# Altium project Guitar_Headphone_Amp.PrjPcb
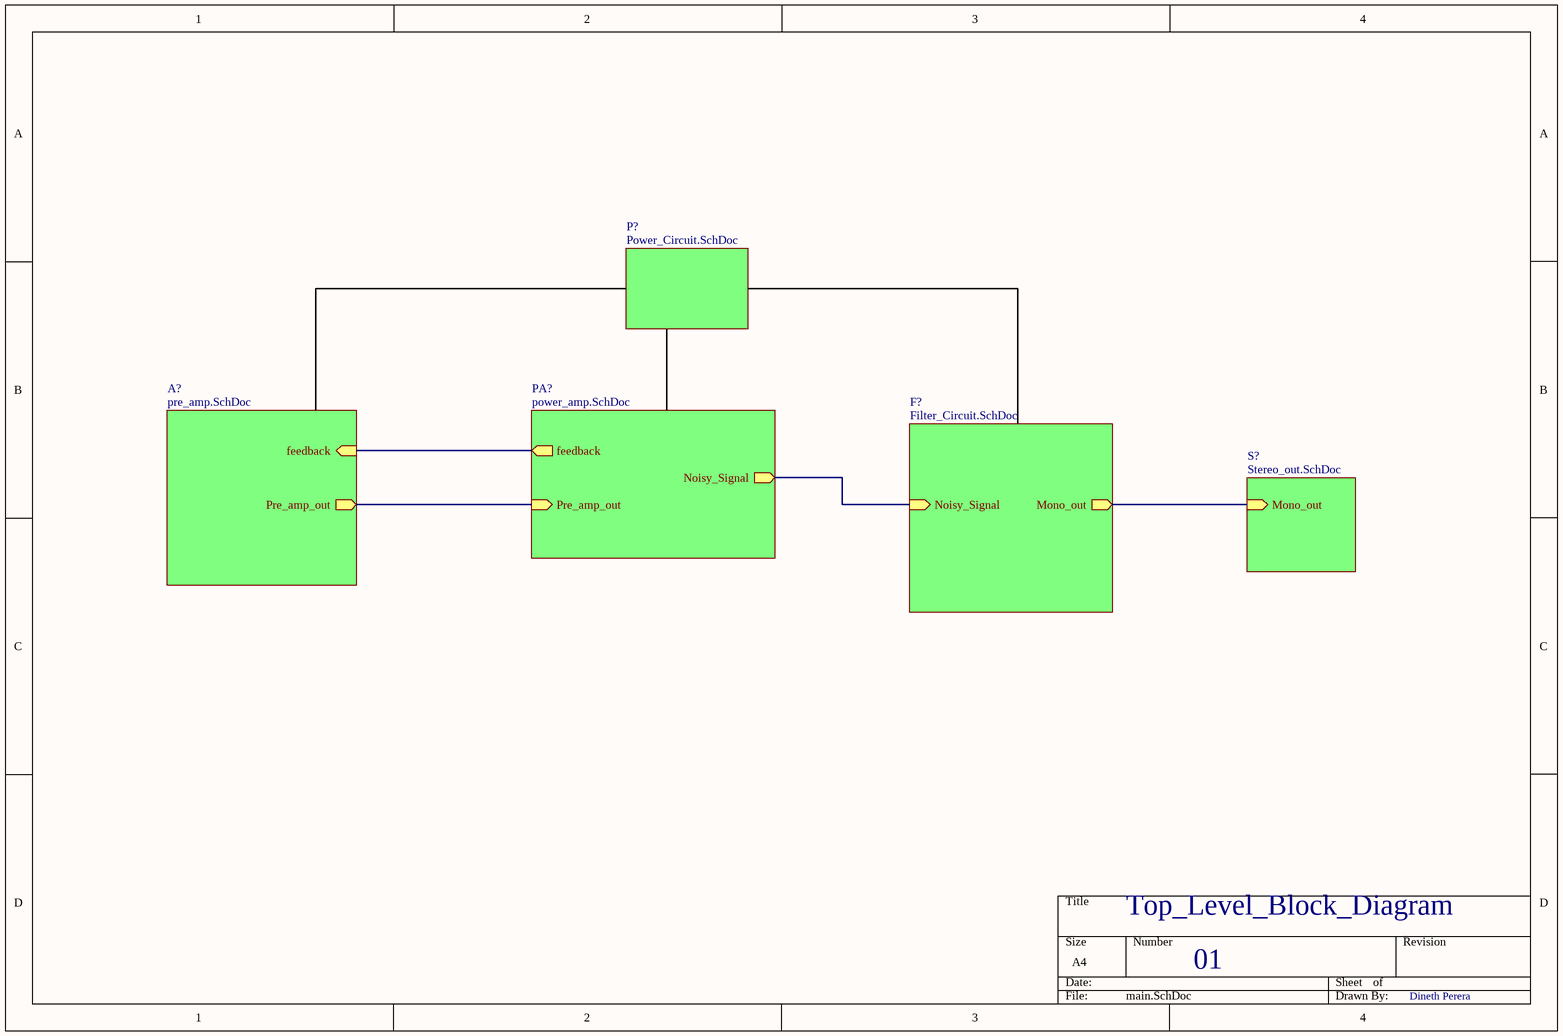
[diagram p0: main.SchDoc]
4 sheets, 20 parts. Net scope: hierarchical (ports join the sheet entries above them; power ports are global).
Board file: Guitar_Headphone_Amp.PcbDoc
Sheets:
  main.SchDoc
    A? = pre_amp.SchDoc
    PA? = power_amp.SchDoc
    P? = Power_Circuit.SchDoc

## Sheet main.SchDoc
size A4; SheetNumber: 1; SheetTotal: 6

### Sub-sheets
A? = pre_amp.SchDoc: feedback (in), Pre_amp_out (out)
F? = Filter_Circuit.SchDoc (file not in this document): Noisy_Signal (in), Mono_out (out)
P? = Power_Circuit.SchDoc: no entries
PA? = power_amp.SchDoc: feedback (out), Pre_amp_out (in), Noisy_Signal (out)
S? = Stereo_out.SchDoc (file not in this document): Mono_out (in)

### Nets
NetD1_1: sheet A?/Pre_amp_out, sheet PA?/Pre_amp_out
NetR2_2: sheet A?/feedback, sheet PA?/feedback
NetR6_1: sheet PA?/Noisy_Signal, sheet F?/Noisy_Signal
(unnamed): sheet F?/Mono_out, sheet S?/Mono_out

### Notes on the sheet
- Top_Level_Block_Diagram
- 01
- Dineth Perera

## Sheet pre_amp.SchDoc
size A4; SheetNumber: 2; SheetTotal: 6
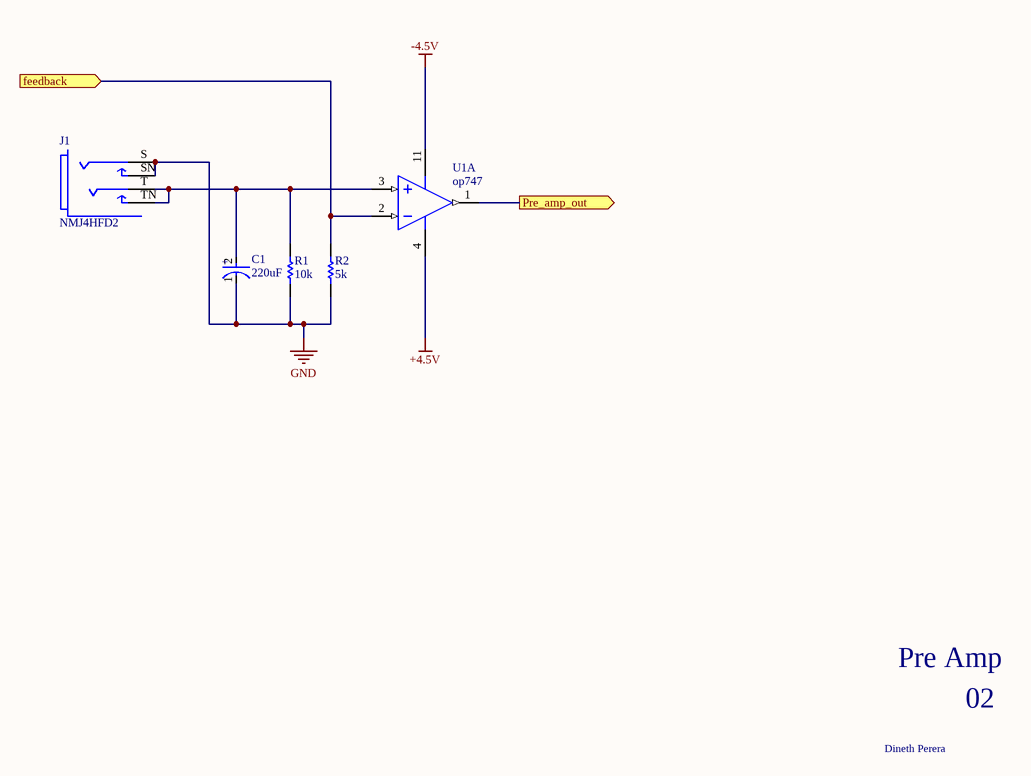
[diagram p1: pre_amp.SchDoc]

### Parts
C1  220uF  [FP-FTF-MFG]
J1  NMJ4HFD2  [FP-NMJ4HFD2-MFG]
R1  10k  [RESC2013X60X35NL10T20]
R2  5k  [RESC2013X50X30ML20T20]
U1  op747  [ADI-R-14_N]  (part A of 4)

### Ports
feedback (in), Pre_amp_out (out)

### Nets
+4.5V: U1.4(+V)
-4.5V: U1.11(-V)
GND: C1.1(C) J1.S J1.SN R1.1 R2.1
NetC1_2: C1.2(A) J1.T J1.TN R1.2 U1.3(+IN_A)
NetD1_1: U1.1(OUT_A) ; port Pre_amp_out
NetR2_2: R2.2 U1.2(-IN_A) ; port feedback

### Notes on the sheet
- Pre Amp
- 02
- Dineth Perera
- (in symbol CMP-05427-000092-1) +

### Library data of the parts
C1 = CMP-05427-000092-1: CAP ALUM 220UF 20% 50V SMD; Ripple Current (AC): 670mA; Dielectric Material: Aluminium; Life (Hours): 2000Hour; Leakage Current: 110uA; Lead Diameter: 0.9mm; ESR (Equivalent Series Resistance): 180mR; REACH SVHC: No SVHC; Voltage Rating (DC): 50V; Radiation Hardening: No; Capacitance: 220uF; Length: 10.2mm; Construction: Cylindrical; Case/Package: Radial; Series: FT; Lead Free: Lead Free; Voltage Rating: 50V; Tolerance: 20%; Contact Plating: Tin; Number of Pins: 2; Height - Seated (Max): 0.413inch; RoHS Compliant: Yes; Diameter: 8mm; Ripple Current: 670mA; Lead Pitch: 3.1mm; Termination: SMD/SMT; Mount: Surface Mount; Min Operating Temperature: -55°C; Max Operating Temperature: 105°C; Voltage: 50V; Height: 10.2mm; Package Quantity: 500; Packaging: Tape and Reel
J1 = CMP-78736-000001-1: Conn 1/4" Mono Jack F 3 POS Solder RA Thru-Hole 3 Terminal 1 Port; Manufacturer: Neutrik; Number Of Contacts: 2; Current Rating: 0.5A; Voltage Rating: 50V; Conn Orientation: Horizontal; Is Female: yes; Temperature: -25°C to +70°C; ComponentLink2Description: Datasheet; ComponentLink2URL: https://www.neutrik.com/en/product/nmj4hfd2.pdf; Contact Material: Silver; Height: 15.89mm; Package: 0; Mouser Description: Phone Audio Connector, Socket, 2, PCB Mount, Metal Body, Silver Plated Contacts; Manufacturer Part Number: NMJ4HFD2; Automotive: No; RoHS: TRUE; Lead Free: Yes; Device Class L2: Audio / Video Connectors; Device Class L3: unset; Temperature Range Low: -25°C; Category: Conn; Footprint Url: https://www.neutrik.com/media/8576/download/st-nmj4hfd2.pdf?v=1; Temperature Range High: +70°C; Device Class L1: Connectors; Octopart: https://octopart.com/nmj4hfd2-neutrik-758952
R1 = CMP-1659-00013-4: Chip Resistor, 10 KOhm, +/- 1%, 0.125 W, -55 to 155 degC, 0805 (2012 Metric), RoHS, Tape and Reel; Manufacturer: Yageo; Voltage Rating: 150 V; Mount: Surface Mount; ComponentLink1Description: Manufacturer URL; ComponentLink2URL: http://www.yageo.com/documents/recent/PYu-RC_Group_51_RoHS_L_04.pdf; Pins: 2; Length: 2 mm; Min Operating Temperature: -55 degC; Height: 0.5 mm; Mounting Technology: Surface Mount; RoHSCompliant: true; REACH SVHC: No SVHC; ComponentLink1URL: http://www.yageo.com/; Max Operating Temperature: 155 degC; PackageReference: 0805; DatasheetVersion: Rev. 4, 02/2016; Package Quantity: 5000; Packaging: Tape and Reel; ComponentLink2Description: Datasheet; PackageDescription: 2-Pin Surface Mounted Device, Body 2 x 1.25 mm
R2 = CMP-2001-04239-1: Part Number: CRCW08055K00FKTA; Manufacturer: Vishay Dale
U1 = CMP-0384-00387-1: Quad Channel Rail-to-Rail Operational Amplifier, 700 KHz BW, 200 mV/us SR, Industrial, 14-pin SOIC (R-14), Reel; Manufacturer: Analog Devices; PartNumber: OP747ARZ-REEL7; Input Bias Current: 5.5nA; Input Offset Voltage: 30uV; Small Signal Bandwidth: 700KHz; V Span Min: 3V; V Span Max: 36V; Amplifiers Per Package: 4; Iq/Amp: 290uA; DatasheetVersion: Rev. D; Mounting Technology: Surface Mount; ComponentLink1URL: http://www.analog.com/en/index.html; PackageVersion: 060606-A; ComponentLink2Description: Datasheet; ComponentLink2URL: http://www.analog.com/static/imported-files/data_sheets/OP777_727_747.pdf; PackageDescription: 14-Pin Standard Small Outline Package, Body 8.65 x 3.9 mm, Pitch 1.27 mm; PackageReference: R-14; ComponentLink3URL: http://www.analog.com/static/imported-files/packages/PKG_PDF/SOIC_Narrow%20(R)/R_14.pdf; Generic Part Number: OP747; ComponentLink3Description: Package Specification; Slew Rate: 200mV/us; ComponentLink1Description: Manufacturer URL; Code_JEDEC: MS-012-AB

## Sheet power_amp.SchDoc
size A4; SheetNumber: 4; SheetTotal: 6
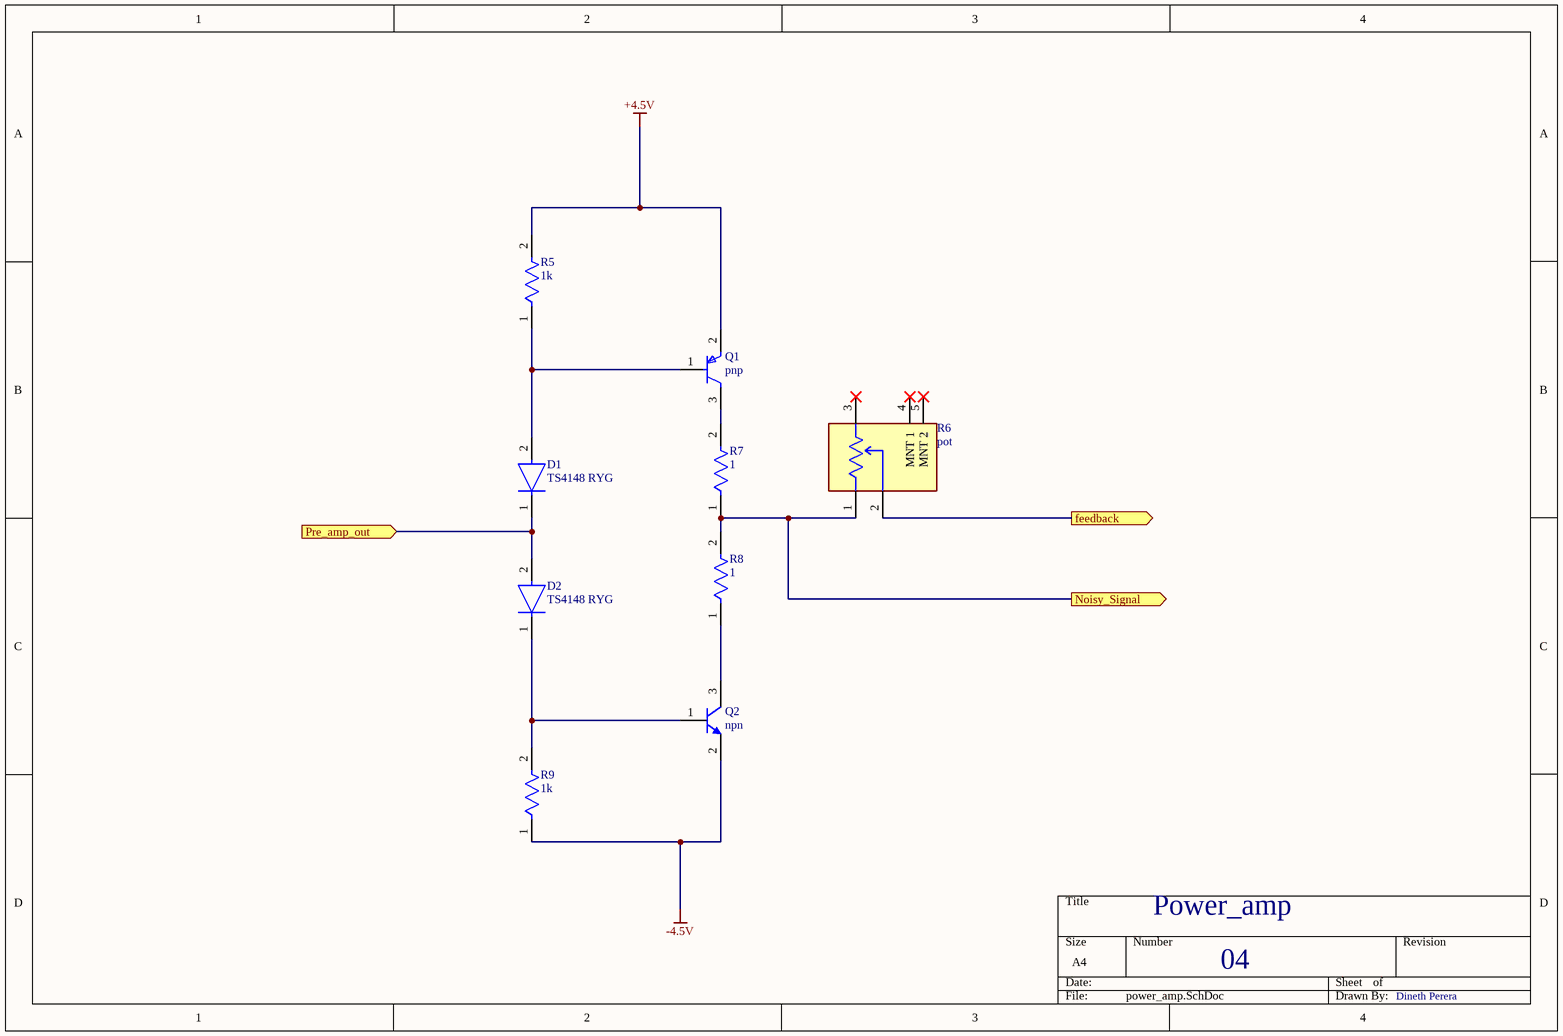
[diagram p2: power_amp.SchDoc]

### Parts
D1  TS4148 RYG  [FP-TS4148_RYG-MFG]
D2  TS4148 RYG  [FP-TS4148_RYG-MFG]
Q1  pnp  [FP-318BM-MFG]
Q2  npn  [INF-SOT23_L]
R5  1k  [FP-ERA6A-IPC_C]
R6  pot  [FP-PTV09A-4-MFG]
R7  1  [FP-CRCW0805-e3-MFG]
R8  1  [FP-CRCW0805-e3-MFG]
R9  1k  [FP-ERA6A-IPC_C]

### Ports
feedback (out), Noisy_Signal (out), Pre_amp_out (in)

### Nets
+4.5V: Q1.2(E) R5.2
-4.5V: Q2.2(E) R9.1
NetD1_1: D1.1(C) D2.2(A) ; port Pre_amp_out
NetD1_2: D1.2(A) Q1.1(B) R5.1
NetD2_1: D2.1(C) Q2.1(B) R9.2
NetQ1_3: Q1.3(C) R7.2
NetQ2_3: Q2.3(C) R8.1
NetR2_2: R6.2 ; port feedback
NetR6_1: R6.1 R7.1 R8.2 ; port Noisy_Signal

Not connected (* = marked no-connect by the designer): R6 3* 4(MNT_1)* 5(MNT_2)*

### Notes on the sheet
- Power_amp
- 04
- Dineth Perera

### Library data of the parts
D1 D2 = CMP-15605-000006-1: Rectifier Diode Switching 75V 0.15A 4ns 2-Pin Case 0805(2012Metric) T/R; Peak Non-Repetitive Surge Current: 2A; Element Configuration: Single; Forward Voltage: 1V; Max Operating Temperature: 175°C; Packaging: Tape and Reel; Radiation Hardening: No; Min Operating Temperature: -65°C; Reverse Recovery Time: 4ns; Mount: Surface Mount; RoHS Compliant: Yes; Max Forward Surge Current (Ifsm): 2A; Case/Package: SMD/SMT; Number of Pins: 2; Max Repetitive Reverse Voltage (Vrrm): 75V
Q1 = CMP-00278-84330287-1: MMBTA56 Small Signal Bipolar Transistor, 0.5A I(C), 80V V(BR)CEO, 1-Element, PNP, Silicon; Manufacturer Lifecycle Status: OBSOLETE; Voltage Rating (DC): -80V; Current Rating: -500mA; Power Dissipation: 350mW; Collector Emitter Breakdown Voltage: 80V; Schedule B: 8541210080, 8541210080; RoHS: Compliant; Number of Pins: 3; NexarPartId: 84330287; Polarity: PNP; Packaging: Digi-Reel®; Lifecycle Status: Obsolete; Lead Free: Lead Free
Q2 = CMP-1177-00051-1: NPN Silicon AF Transistor, 80 V VCEO, 500 mA IC, SOT23, Reel, Green; PartNumber: SMBTA06; Manufacturer: Infineon; IC (max): 500Â mA; ICBO (max): 100Â nA; VCBO (max): 80Â V; Green: TRUE; fT (typ): 100Â MHz; VEBO (max): 4Â V; VCE: 1 V; ICM (max): 1,000Â mA; IC: 100Â mA; IBM (max): 200Â mA; Ptot (max): 330 mW; PackageVersion: Apr-08; ComponentLink3Description: Package Specification; Polarity: NPN; ComponentLink1URL: http://www.infineon.com/; Mounting Technology: Surface Mount; Packing: Reel; ComponentLink2Description: Datasheet; PackageReference: SOT23; ComponentLink3URL: http://www.infineon.com/dgdl/SOT23-Package_Overview.pdf?folderId=db3a30431936bc4b0119532290053c66&fileId=db3a30431936bc4b0119533468123c85; PackageDescription: 3-Pin Small Outline Transistor Package, 1.3 x 2.9 mm Body, 0.95 mm Pitch; VCEO (max): 80Â V; ComponentLink1Description: Manufacturer URL; ComponentLink2URL: http://www.infineon.com/dgdl/smbta06_mmbta06.pdf?folderId=db3a304314dca389011545f4eb561884&fileId=db3a304314dca3890115478ecca71a2d
R5 R9 = CMP-2001-00581-2: RES 1K OHM 0.1% 1/8W 0805; Temperature Coefficient: 25ppm/°C; Resistance: 1kR; Working Voltage: 100V; Max Power Dissipation: 125mW; Height: 0.5mm; Technology: THIN FILM; REACH SVHC: No SVHC; Packaging: Tape and Reel; Length: 2mm; Width: 1.25mm; Resistance Tolerance: 0.1%; Series: ERA-6A; Resistor Type: Thin Film; Number of Pins: 2; Case Code (Metric): 2012; Voltage Rating: 100V; Radiation Hardening: No; Construction: Rectangular; Mount: Surface Mount; Number of Terminations: 2; Case/Package: 0805; Min Operating Temperature: -55°C; Military Standard: Not; RoHS Compliant: Yes; Termination: SMD/SMT; Case Code (Imperial): 0805; Depth: 1.25mm; Power Rating: 125mW; Max Operating Temperature: 155°C; Contact Plating: Tin; Package Quantity: 5000; Tolerance: 0.1%
R6 = CMP-07234-000013-1: POT 10K OHM 1/20W CARBON LINEAR; Manufacturer Part Number: PTV09A-4020U-B103; Manufacturer: Bourns Inc.; Voltage Rating: 50V; Resistance: 10kΩ; Description: Res Carbon Film POT 10K Ohm 20% 1/20W 1(Elec)/1(Mech)Turn 6mm Pin Bracket Mount/Through Hole; Tolerance: 20%; Value: 10kΩ; Power Rating: 0.05W; Composition: Carbon; Lead Free: Yes; Device Class L1: Passive Components; Device Class L3: Variable Resistors and Potentiometers; Temperature: -10°C to +50°C; Series: PTV09; Device Class L2: Resistors; Temperature Range Low: -10°C; Height: 20.5mm; Temperature Range High: +50°C; Octopart: https://octopart.com/ptv09a-4020u-b103-bourns-1878033; Digikey Description: POT 10K OHM 1/20W CARBON LINEAR; RoHS: TRUE; ComponentLink2URL: https://www.bourns.com/docs/product-datasheets/ptv09.pdf?sfvrsn=5e1089f1_12; Package: PTV09A-4; Mouser Description: Potentiometers 10K LINEAR 20%; Category: Res; ComponentLink2Description: Datasheet; Automotive: No
R7 R8 = CMP-2001-03649-2: RES Thick Film, 1Ω, 1%, 0.125W, 100ppm/°C, 0805; Power Rating: 125mW; Resistance: 1R; Voltage Rating: 150V; Number of Terminations: 2; Mount: Surface Mount; Packaging: Tape and Reel; Radiation Hardening: No; Number of Pins: 2; Case Code (Imperial): 0805; Contact Plating: Tin; Military Standard: Not; Min Operating Temperature: -55°C; Case Code (Metric): 2012; Max Operating Temperature: 155°C; Max Power Dissipation: 125mW; Termination: SMD/SMT; Weight: 0.000194oz; Case/Package: 0805; Width: 0.049inch; Temperature Coefficient: 100ppm/°C; Package Quantity: 10; Composition: Thick Film; Tolerance: 1%; Height: 0.02inch; Depth: 1.25mm; Length: 2mm; Features: Automotive AEC-Q200

## Sheet Power_Circuit.SchDoc
size A4; SheetNumber: 3; SheetTotal: 6
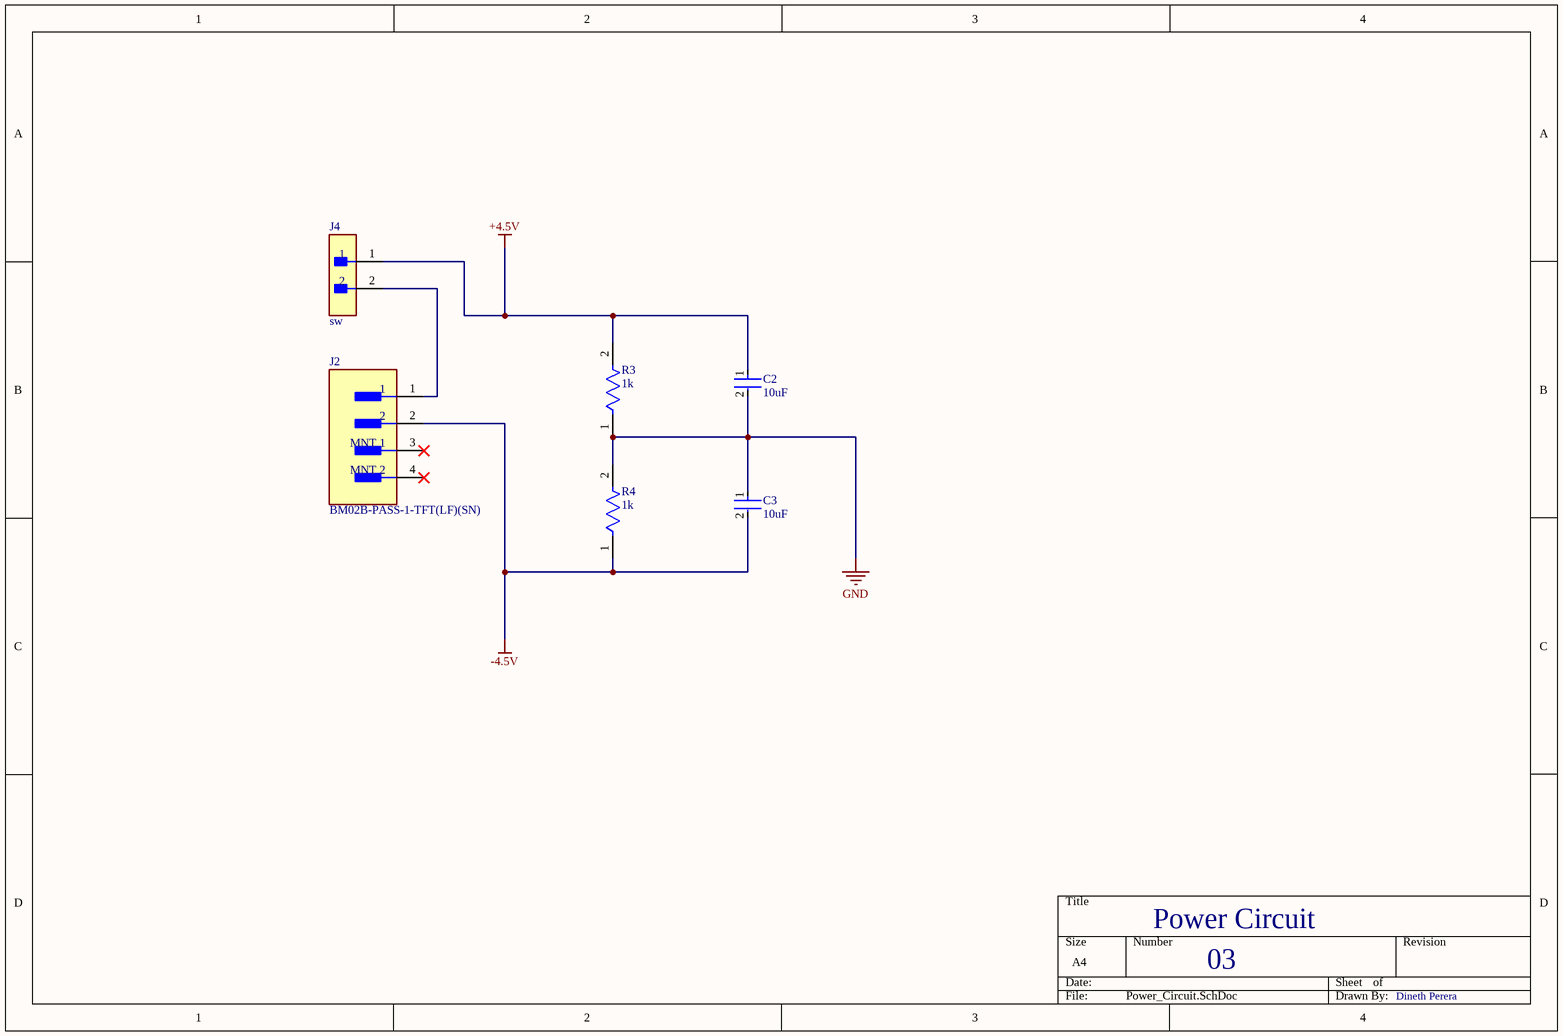
[diagram p3: Power_Circuit.SchDoc]

### Parts
C2  10uF  [FP-GRM21B-0_1-IPC_C]
C3  10uF  [FP-GRM21B-0_1-IPC_C]
J2  BM02B-PASS-1-TFT(LF)(SN)  [FP-BM02B-PASS-1-TFT_LF_S-MFG]
J4  sw  [FP-B02B-PASK-1_LF_SN-MFG]
R3  1k  [FP-ERA6A-IPC_C]
R4  1k  [FP-ERA6A-IPC_C]

### Nets
+4.5V: C2.1 J4.1 R3.2
-4.5V: C3.2 J2.2 R4.1
GND: C2.2 C3.1 R3.1 R4.2
NetJ2_1: J2.1 J4.2

Not connected (* = marked no-connect by the designer): J2 3(MNT_1)* 4(MNT_2)*

### Notes on the sheet
- Power Circuit
- 03
- Dineth Perera

### Library data of the parts
C2 C3 = CMP-2007-03453-2: Chip Multilayer Ceramic Capacitors for General Purpose, 0805, 10uF, X5R, 15%, 10%, 16V; Radiation Hardening: No; Thickness: 0.053inch; Voltage Rating (DC): 16V; Lead Free: Lead Free; Package Quantity: 1; Width: 1.25mm; Case Code (Imperial): 0805; Depth: 1.25mm; Packaging: Tape and Reel; Dielectric: X5R; Max Operating Temperature: 85°C; Tolerance: 10%; Voltage Rating: 16V; Voltage: 16V; Capacitance: 10uF; Height: 1.25mm; Case Code (Metric): 2012; Material: Ceramic; Mount: Surface Mount; Case/Package: 0805; REACH SVHC: No SVHC; Length: 2mm; Min Operating Temperature: -55°C; Termination: SMD/SMT
J2 = CMP-17439-000073-1: CONN HEADER SMD 2POS 2MM; Number of Positions: 2; Gender: Male; Pitch: 0.079inch; Connector Type: Male Pin; Contact Plating: Tin; Contact Material: Copper; Color: Natural; Packaging: Tape and Reel; Series: PA; Termination: Solder; Mount: Surface Mount; Fastening Type: Ramp; Number of Rows: 1; Lead Free: Lead Free; Number of Contacts: 2; Contact Type: Male Pin
J4 = CMP-17439-000415-1: CONN HEADER VERT 2POS 2MM; Number of Contacts: 2; Current Rating: 3A; Insulation Resistance: 1GR; Mated Stacking Heights: 14.9mm; Voltage Rating: 250V; Gender: Male; Pitch: 2mm; Orientation: Straight; Contact Finish - Mating: TIN; Mount: Through Hole; Contact Type: Male Pin; Number of Rows: 1; Fastening Type: Ramp; Series: PA; Connector Type: Header; Insulation Color: Natural; Flammability Rating: UL94 V-0; Material: Polybutylene; Contact Shape: Square; Contact Plating: Tin; Insulation Material: PBT; Max Operating Temperature: 85°C; Housing Color: White; Number of Positions: 2; Contact Material: Copper Alloy; Min Operating Temperature: -25°C; Lead Free: Lead Free; Contact Mating Length: 0.126inch; Termination: Solder; Packaging: Bulk; Color: Natural
R3 R4 = CMP-2001-00581-2: as R5 on sheet power_amp; Height: 0.5mm; Technology: THIN FILM; REACH SVHC: No SVHC; Packaging: Tape and Reel; Length: 2mm; Width: 1.25mm; Resistance Tolerance: 0.1%; Series: ERA-6A; Resistor Type: Thin Film; Number of Pins: 2; Case Code (Metric): 2012; Voltage Rating: 100V; Radiation Hardening: No; Construction: Rectangular; Mount: Surface Mount; Number of Terminations: 2; Case/Package: 0805; Min Operating Temperature: -55°C; Military Standard: Not; RoHS Compliant: Yes; Termination: SMD/SMT; Case Code (Imperial): 0805; Depth: 1.25mm; Power Rating: 125mW; Max Operating Temperature: 155°C; Contact Plating: Tin; Package Quantity: 5000; Tolerance: 0.1%

## Nets that join several sheets
+4.5V: pre_amp (U1.4), power_amp (Q1.2 R5.2), Power_Circuit (C2.1 J4.1 R3.2)
-4.5V: pre_amp (U1.11), power_amp (Q2.2 R9.1), Power_Circuit (C3.2 J2.2 R4.1)
GND: pre_amp (5 pins), Power_Circuit (C2.2 C3.1 R3.1 R4.2)
NetD1_1: pre_amp (U1.1), power_amp (D1.1 D2.2)
NetR2_2: pre_amp (R2.2 U1.2), power_amp (R6.2)